# Altium schematic sheet Top_level_sch.SchDoc
size A; SheetNumber: 1; SheetTotal: 6
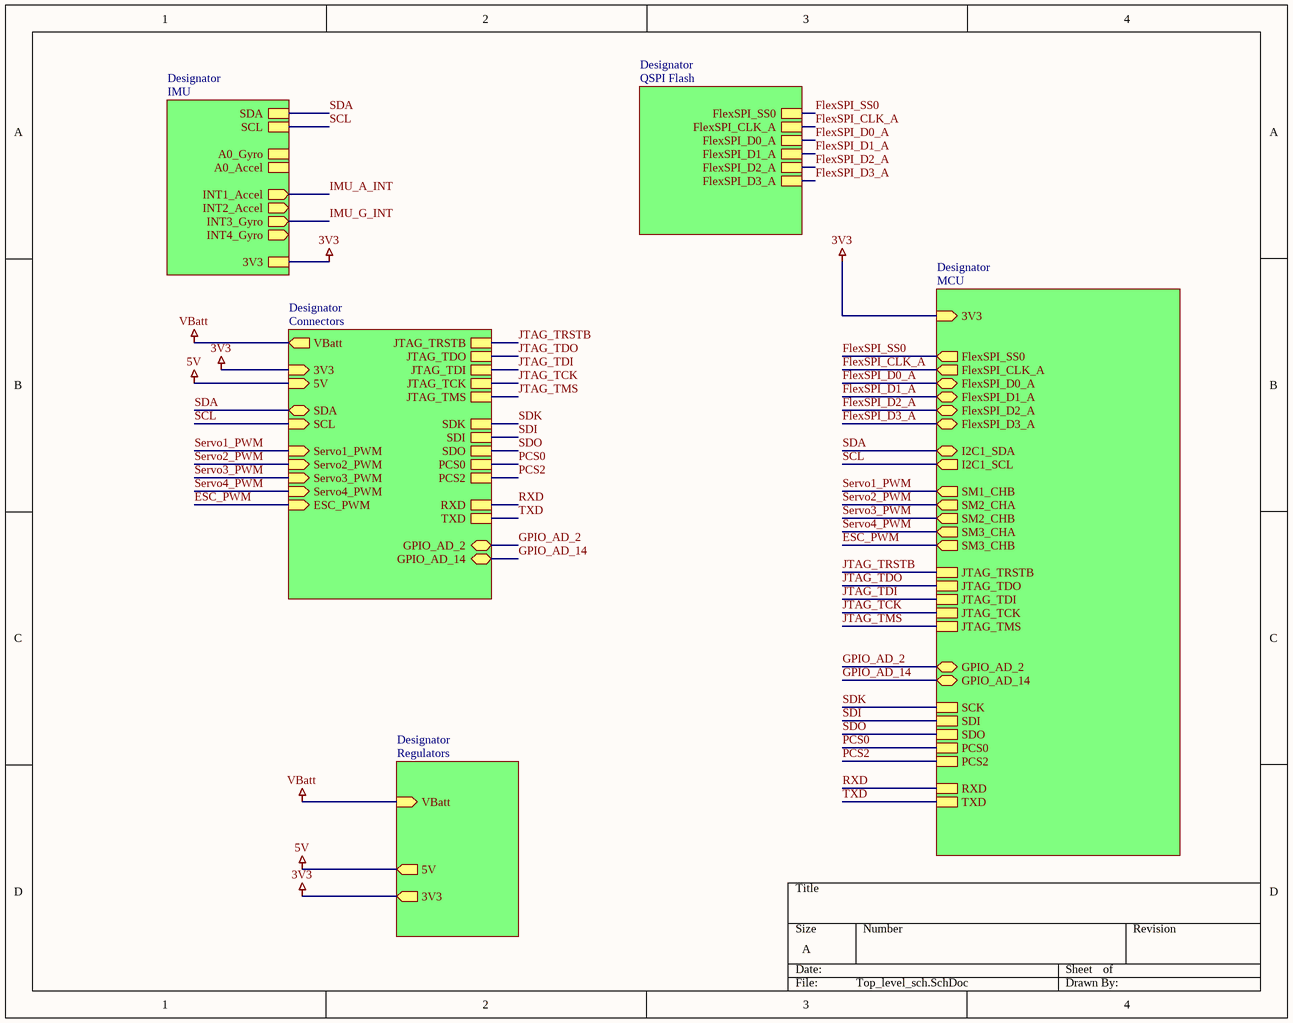
[diagram p0: Top_level_sch.SchDoc]

## Sub-sheets
Designator = MCU: I2C1_SCL (out), I2C1_SDA (bidir), JTAG_TRSTB, JTAG_TDO, JTAG_TDI, JTAG_TCK, JTAG_TMS, 3V3 (in), SM2_CHA (out), SM2_CHB (out), SM1_CHB (out), SM3_CHB (out), SM3_CHA (out), GPIO_AD_2 (bidir), GPIO_AD_14 (bidir), SCK, SDI, SDO, PCS0, PCS2, RXD, TXD, FlexSPI_SS0 (out), FlexSPI_D1_A (bidir), FlexSPI_D2_A (bidir), FlexSPI_D0_A (bidir), FlexSPI_CLK_A (out), FlexSPI_D3_A (bidir)
Designator = IMU: SCL, INT1_Accel (out), INT3_Gyro (out), SDA, INT4_Gyro (out), INT2_Accel (out), A0_Accel, A0_Gyro, 3V3
Designator = Connectors: SDA (bidir), SCL (in), 5V (in), 3V3 (in), Servo1_PWM (in), ESC_PWM (in), VBatt (out), Servo2_PWM (in), Servo3_PWM (in), Servo4_PWM (in), JTAG_TRSTB, JTAG_TDO, JTAG_TDI, JTAG_TCK, JTAG_TMS, SDK, SDI, SDO, PCS0, PCS2, RXD, TXD, GPIO_AD_2 (bidir), GPIO_AD_14 (bidir)
Designator = Regulators: VBatt (in), 5V (out), 3V3 (out)
Designator = QSPI Flash: FlexSPI_D0_A, FlexSPI_CLK_A, FlexSPI_SS0, FlexSPI_D2_A, FlexSPI_D3_A, FlexSPI_D1_A

## Nets
3V3: sheet Designator/3V3, sheet Designator/3V3, sheet Designator/3V3, sheet Designator/3V3
5V: sheet Designator/5V, sheet Designator/5V
VBatt: sheet Designator/VBatt, sheet Designator/VBatt
ESC_PWM: sheet Designator/SM3_CHB, sheet Designator/ESC_PWM
FlexSPI_CLK_A: sheet Designator/FlexSPI_CLK_A, sheet Designator/FlexSPI_CLK_A
FlexSPI_D0_A: sheet Designator/FlexSPI_D0_A, sheet Designator/FlexSPI_D0_A
FlexSPI_D1_A: sheet Designator/FlexSPI_D1_A, sheet Designator/FlexSPI_D1_A
FlexSPI_D2_A: sheet Designator/FlexSPI_D2_A, sheet Designator/FlexSPI_D2_A
FlexSPI_D3_A: sheet Designator/FlexSPI_D3_A, sheet Designator/FlexSPI_D3_A
FlexSPI_SS0: sheet Designator/FlexSPI_SS0, sheet Designator/FlexSPI_SS0
GPIO_AD_2: sheet Designator/GPIO_AD_2, sheet Designator/GPIO_AD_2
GPIO_AD_14: sheet Designator/GPIO_AD_14, sheet Designator/GPIO_AD_14
IMU_A_INT: sheet Designator/INT1_Accel
IMU_G_INT: sheet Designator/INT3_Gyro
JTAG_TCK: sheet Designator/JTAG_TCK, sheet Designator/JTAG_TCK
JTAG_TDI: sheet Designator/JTAG_TDI, sheet Designator/JTAG_TDI
JTAG_TDO: sheet Designator/JTAG_TDO, sheet Designator/JTAG_TDO
JTAG_TMS: sheet Designator/JTAG_TMS, sheet Designator/JTAG_TMS
JTAG_TRSTB: sheet Designator/JTAG_TRSTB, sheet Designator/JTAG_TRSTB
PCS0: sheet Designator/PCS0, sheet Designator/PCS0
PCS2: sheet Designator/PCS2, sheet Designator/PCS2
RXD: sheet Designator/RXD, sheet Designator/RXD
SCL: sheet Designator/I2C1_SCL, sheet Designator/SCL, sheet Designator/SCL
SDA: sheet Designator/I2C1_SDA, sheet Designator/SDA, sheet Designator/SDA
SDI: sheet Designator/SDI, sheet Designator/SDI
SDK: sheet Designator/SCK, sheet Designator/SDK
SDO: sheet Designator/SDO, sheet Designator/SDO
Servo1_PWM: sheet Designator/SM1_CHB, sheet Designator/Servo1_PWM
Servo2_PWM: sheet Designator/SM2_CHA, sheet Designator/Servo2_PWM
Servo3_PWM: sheet Designator/SM2_CHB, sheet Designator/Servo3_PWM
Servo4_PWM: sheet Designator/SM3_CHA, sheet Designator/Servo4_PWM
TXD: sheet Designator/TXD, sheet Designator/TXD